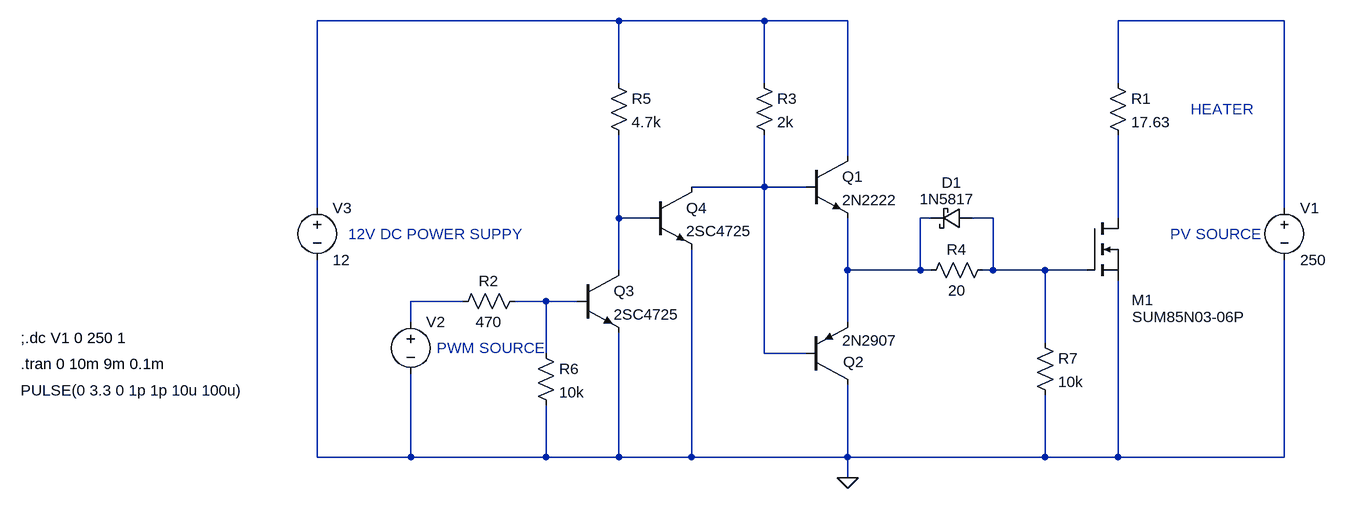
[diagram p0: schematic pwm_nmos_driver.asc]
pwm_nmos_driver.asc, the LTspice schematic file:
Version 4
SHEET 1 1204 680
WIRE -384 -208 -848 -208
WIRE -160 -208 -384 -208
WIRE -32 -208 -160 -208
WIRE 640 -208 384 -208
WIRE -384 -112 -384 -208
WIRE -160 -112 -160 -208
WIRE 384 -112 384 -208
WIRE -32 0 -32 -208
WIRE -160 48 -160 -32
WIRE -160 48 -272 48
WIRE -96 48 -160 48
WIRE -848 80 -848 -208
WIRE 640 80 640 -208
WIRE -384 96 -384 -32
WIRE -336 96 -384 96
WIRE 96 96 80 96
WIRE 192 96 160 96
WIRE 384 96 384 -32
WIRE -384 176 -384 96
WIRE -32 176 -32 96
WIRE 80 176 80 96
WIRE 80 176 -32 176
WIRE 96 176 80 176
WIRE 192 176 192 96
WIRE 192 176 176 176
WIRE 272 176 192 176
WIRE 336 176 272 176
WIRE -624 224 -704 224
WIRE -496 224 -544 224
WIRE -448 224 -496 224
WIRE -704 256 -704 224
WIRE -32 256 -32 176
WIRE 272 288 272 176
WIRE -496 304 -496 224
WIRE -160 304 -160 48
WIRE -96 304 -160 304
WIRE -848 464 -848 160
WIRE -704 464 -704 336
WIRE -704 464 -848 464
WIRE -496 464 -496 384
WIRE -496 464 -704 464
WIRE -384 464 -384 272
WIRE -384 464 -496 464
WIRE -272 464 -272 144
WIRE -272 464 -384 464
WIRE -32 464 -32 352
WIRE -32 464 -272 464
WIRE 272 464 272 368
WIRE 272 464 -32 464
WIRE 384 464 384 192
WIRE 384 464 272 464
WIRE 640 464 640 160
WIRE 640 464 384 464
WIRE -32 496 -32 464
FLAG -32 496 0
SYMBOL voltage 640 64 R0
WINDOW 123 0 0 Left 0
WINDOW 39 0 0 Left 0
SYMATTR InstName V1
SYMATTR Value 250
SYMBOL res 368 -128 R0
SYMATTR InstName R1
SYMATTR Value 17.63
SYMBOL voltage -704 240 R0
WINDOW 123 0 0 Left 0
WINDOW 39 0 0 Left 0
WINDOW 3 -600 121 Left 2
SYMATTR Value PULSE(0 3.3 0 1p 1p 10u 100u)
SYMATTR InstName V2
SYMBOL nmos 336 96 R0
WINDOW 0 69 126 Left 2
WINDOW 3 70 152 Left 2
SYMATTR InstName M1
SYMATTR Value SUM85N03-06P
SYMBOL voltage -848 64 R0
WINDOW 123 0 0 Left 0
WINDOW 39 0 0 Left 0
SYMATTR InstName V3
SYMATTR Value 12
SYMBOL npn -96 0 R0
SYMATTR InstName Q1
SYMATTR Value 2N2222
SYMBOL pnp -96 352 M180
WINDOW 0 57 35 Left 2
WINDOW 3 56 68 Left 2
SYMATTR InstName Q2
SYMATTR Value 2N2907
SYMBOL res -528 208 R90
WINDOW 0 0 56 VBottom 2
WINDOW 3 32 56 VTop 2
SYMATTR InstName R2
SYMATTR Value 470
SYMBOL res -176 -128 R0
SYMATTR InstName R3
SYMATTR Value 2k
SYMBOL res 192 160 R90
WINDOW 0 0 56 VBottom 2
WINDOW 3 32 56 VTop 2
SYMATTR InstName R4
SYMATTR Value 20
SYMBOL npn2 -448 176 R0
SYMATTR InstName Q3
SYMATTR Value 2SC4725
SYMBOL schottky 160 80 R90
WINDOW 0 -23 32 VBottom 2
WINDOW 3 -29 39 VTop 2
SYMATTR InstName D1
SYMATTR Value 1N5817
SYMATTR Description Diode
SYMATTR Type diode
SYMBOL res -400 -128 R0
SYMATTR InstName R5
SYMATTR Value 4.7k
SYMBOL npn2 -336 48 R0
SYMATTR InstName Q4
SYMATTR Value 2SC4725
SYMBOL res -512 288 R0
SYMATTR InstName R6
SYMATTR Value 10k
SYMBOL res 256 272 R0
SYMATTR InstName R7
SYMATTR Value 10k
TEXT -1304 280 Left 2 !;.dc V1 0 250 1
TEXT -1304 320 Left 2 !.tran 0 10m 9m 0.1m
TEXT 496 -72 Left 2 ;HEATER
TEXT 464 120 Left 2 ;PV SOURCE
TEXT -800 120 Left 2 ;12V DC POWER SUPPY
TEXT -664 296 Left 2 ;PWM SOURCE

The netlist it stands for:
* pwm_nmos_driver.asc
V1 N002 0 250
R1 N002 N007 17.63
V2 N008 0 PULSE(0 3.3 0 1p 1p 10u 100u)
M1 N007 N006 0 0 SUM85N03-06P
V3 N001 0 12
Q1 N001 N003 N005 0 2N2222
Q2 0 N003 N005 0 2N2907
R2 N009 N008 470
R3 N001 N003 2k
R4 N006 N005 20
Q3 N004 N009 0 0 2SC4725
D1 N006 N005 1N5817
R5 N001 N004 4.7k
Q4 N003 N004 0 0 2SC4725
R6 N009 0 10k
R7 N006 0 10k
.model D D
.lib standard.dio
.model NPN NPN
.model PNP PNP
.lib standard.bjt
.model NMOS NMOS
.model PMOS PMOS
.lib standard.mos
;.dc V1 0 250 1
.tran 0 10m 9m 0.1m
* HEATER
* PV SOURCE
* 12V DC POWER SUPPY
* PWM SOURCE
.backanno
.end